# EasyEDA schematic LoRaCam.json
TITLE: LoRaCam; REV: 1.0; Date: 20-08-2023; Sheet: 1/1; Company: Pagano Electronics
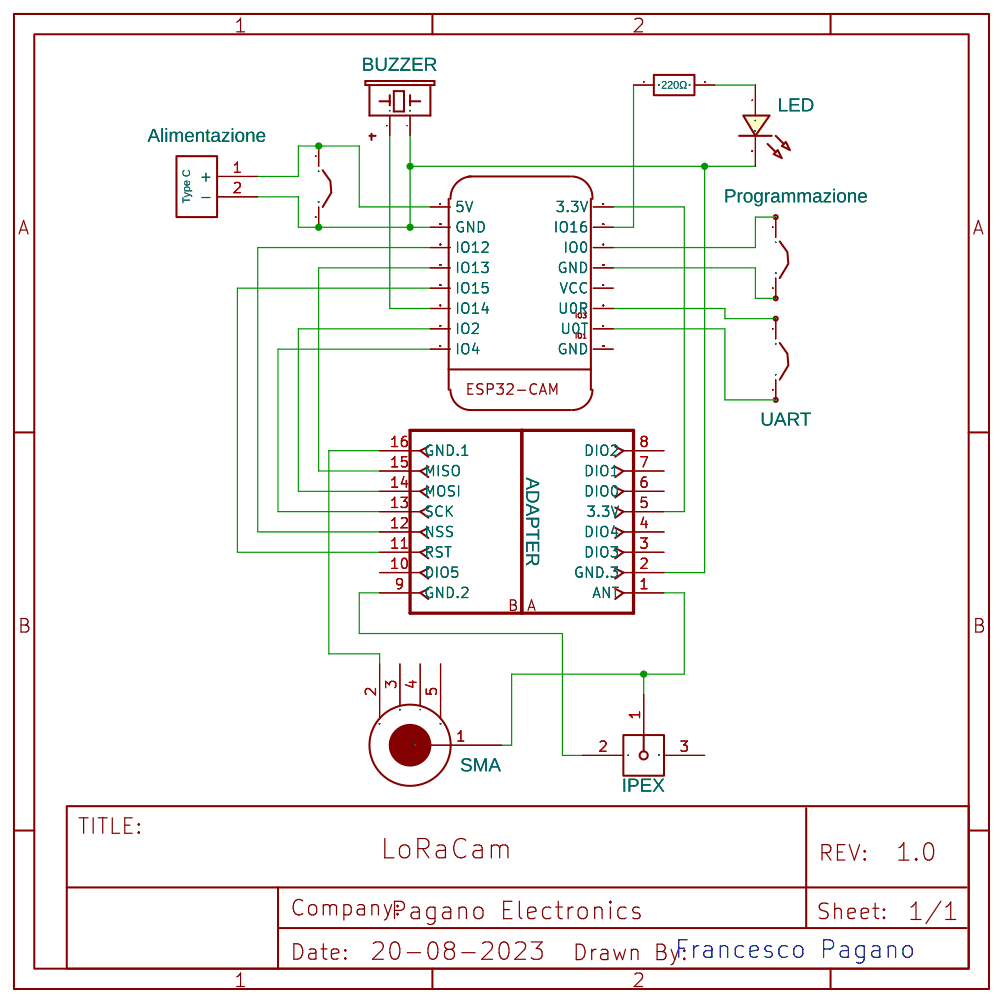
[diagram p0: schematic sheet]

## Parts
B  BUZZER  [BUZZER-12MM]
ESP32CAM  ESP32CAM  [ESP32CAM_BOARD]
IPEX  IPEX  [IPEX-SMD_HC-RF-IPEX0303-01]
J1  Programmazione  [HDR-TH_2P-P2.54-V-M-1]
J2  UART  [HDR-TH_2P-P2.54-V-M-1]
J3  Alimentazione  [HDR-TH_2P-P2.54-V-M-1]
LED  LED  [LED-TH_BD3.0_RED]
LORA  ADAPTER  [ESP8266-ADAPTER]
R1  220Ω  [R0603]
SMA  SMA  [SMA FEMALE VERTICAL MOUNT [PCB]]
TYPEC  Type C  [USB TYPE C 2 PIN]

## Library data of the parts
B = BUZZER: Contributor: SparkFun
ESP32CAM = ESP32CAM: Contributor: sakuyaki
IPEX = IPEX: Supplier: LCSC; Supplier Part: C2894919; Manufacturer: HCTL(华灿天禄); Manufacturer Part: HC-RF-IPEX0303-01; Contributor: LCSC
J1-J3 = JUMPERTHRUHOLE: Supplier Part: NONE; Manufacturer: NONE; Manufacturer Part: NONE; Contributor: RaspAutomacao
LED = LED-TH-3mm_R: Manufacturer: EVERLIGHT(台湾亿光); Manufacturer Part: 204-10SDRD/S530-A3-L; Supplier Part: C84774; Supplier: LCSC; Contributor: LCEDA_Lib
LORA = ESP8266-WITH-ADAPTER: Contributor: mratix
R1 = R_0603_EU: Contributor: LCEDA_Lib
SMA = SMA FEMALE VERTICAL MOUNT: Manufacturer: SHIVRAM; Manufacturer Part: SMA-VERTICAL; Supplier: SHIVRAM; Supplier Part: SMA-VERTICAL; Contributor: Dhawal Agrawal
TYPEC = usb type C 2 pin: Contributor: zikratiy

## Nets
Net-(B-+): B.+(1) ESP32CAM.IO14
Net-(B--): B.-(2) ESP32CAM.GND@1(GND) J3.2 LED.2 LORA.2(GND.3) TYPEC.2(-)
Net-(ESP32CAM-3.3V): ESP32CAM.3.3V LORA.5(3.3V)
Net-(ESP32CAM-5V): ESP32CAM.5V J3.1 TYPEC.1(+)
Net-(ESP32CAM-GND@2): ESP32CAM.GND@2(GND) J1.2
Net-(ESP32CAM-IO0): ESP32CAM.IO0 J1.1
Net-(ESP32CAM-IO2): ESP32CAM.IO2 LORA.14(MOSI)
Net-(ESP32CAM-IO4): ESP32CAM.IO4 LORA.13(SCK)
Net-(ESP32CAM-IO12): ESP32CAM.IO12 LORA.12(NSS)
Net-(ESP32CAM-IO13): ESP32CAM.IO13 LORA.15(MISO)
Net-(ESP32CAM-IO15): ESP32CAM.IO15 LORA.11(RST)
Net-(ESP32CAM-IO16): ESP32CAM.IO16 R1.1
Net-(ESP32CAM-UDR): ESP32CAM.UDR(U0R) J2.1
Net-(ESP32CAM-UDT): ESP32CAM.UDT(U0T) J2.2
Net-(IPEX-1): IPEX.1 LORA.1(ANT) SMA.1
Net-(IPEX-2): IPEX.2 LORA.9(GND.2)
Net-(LED-1): LED.1 R1.2
Net-(LORA-16): LORA.16(GND.1) SMA.2

Not connected (* = marked no-connect by the designer): ESP32CAM GND@3(GND) VCC; IPEX 3; LORA 3(DIO3) 4(DIO4) 6(DIO0) 7(DIO1) 8(DIO2) 10(DIO5); SMA 3 4 5

## Notes on the sheet
- Francesco Pagano
